# Altium project maze.PrjPCB
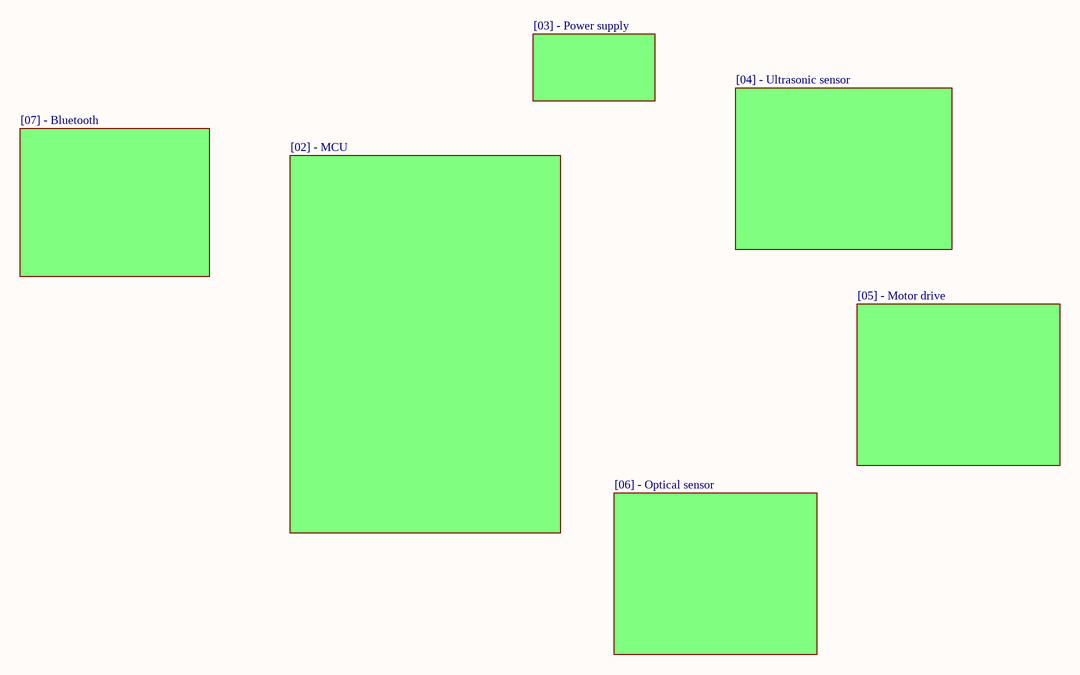
[diagram p0: [01] - sheet_connector.SchDoc]
3 sheets, 28 parts. Net scope: flat (ports and power ports of the same name join across sheets).
Sheets:
  [01] - sheet_connector.SchDoc
    Designator = [02] - MCU.SchDoc
    Designator = [03] - Power supply.SchDoc

## Sheet [01] - sheet_connector.SchDoc
size A4

### Sub-sheets
Designator = [02] - MCU: no entries
Designator = [04] - Ultrasonic sensor (file not in this document): no entries
Designator = [05] - Motor drive (file not in this document): no entries
Designator = [07] - Bluetooth (file not in this document): no entries
Designator = [06] - Optical sensor (file not in this document): no entries
Designator = [03] - Power supply: no entries

### Notes on the sheet
- Title
- Size:
- Date:
- A4
- Number:
- Time:
- Revision:
- Sheet
- of
- File:

## Sheet [02] - MCU.SchDoc
size A4
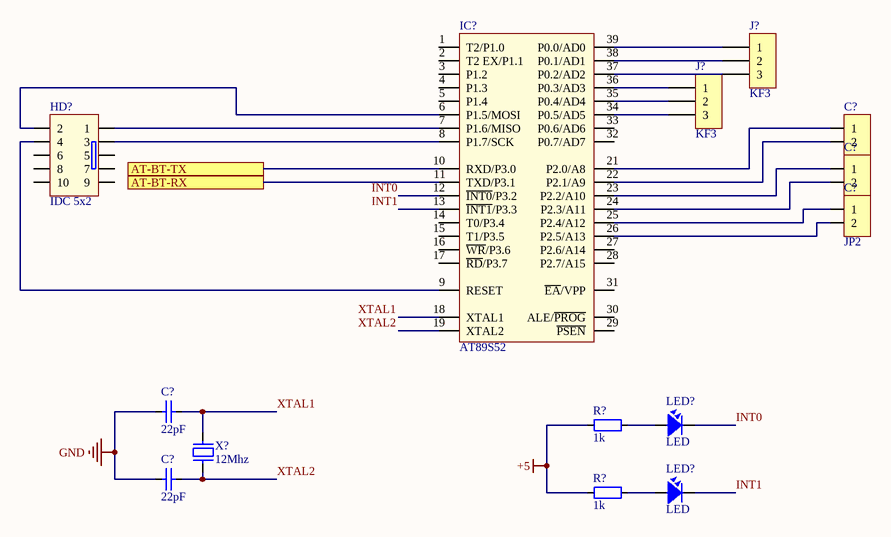
[diagram p1: [02] - MCU.SchDoc]

### Parts
(Parts that share a designator on the sheet are numbered #1, #2 ... from top to bottom, then left to right.)
C?#1  JP2  [JP2-C1T]
C?#2  JP2  [JP2-C1T]
C?#3  JP2  [JP2-C1T]
C?#4  22pF  [CAP_0402]
C?#5  22pF  [CAP_0402]
HD?  IDC 5x2  [IDC10-BH]
IC?  AT89S52  [DIP40/W0.6]
J?#1  KF3  [KF3-5.08T]
J?#2  KF3  [KF3-5.08T]
LED?#1  LED  [LED-3]
LED?#2  LED  [LED-3]
R?#1  1k  [RES-SMD-0402]
R?#2  1k  [RES-SMD-0402]
X?  12Mhz  [XT2]

### Ports
AT-BT-RX, AT-BT-TX

### Nets
+5: R?#1.1 R?#2.1
GND: C?#4.1 C?#5.1 IC?.20(GND)
VCC: IC?.40(VCC)
INT0: LED?#1.2
INT1: LED?#2.2
XTAL1: C?#4.2 X?.2
XTAL2: C?#5.2 X?.1
NetC?#1_1: C?#1.1 IC?.21(P2.0/A8)
NetC?#1_2: C?#1.2 IC?.22(P2.1/A9)
NetC?#2_1: C?#2.1 IC?.23(P2.2/A10)
NetC?#2_2: C?#2.2 IC?.24(P2.3/A11)
NetC?#3_1: C?#3.1 IC?.25(P2.4/A12)
NetC?#3_2: C?#3.2 IC?.26(P2.5/A13)
NetHD?_1: HD?.1 IC?.7(P1.6/MISO)
NetHD?_2: HD?.2 IC?.6(P1.5/MOSI)
NetHD?_3: HD?.3 IC?.8(P1.7/SCK)
NetHD?_4: HD?.4 IC?.9(RESET)
NetIC?_10: IC?.10(RXD/P3.0) ; port AT-BT-TX
NetIC?_11: IC?.11(TXD/P3.1) ; port AT-BT-RX
NetIC?_34: IC?.34(P0.5/AD5) J?#2.3
NetIC?_35: IC?.35(P0.4/AD4) J?#2.2
NetIC?_36: IC?.36(P0.3/AD3) J?#2.1
NetIC?_37: IC?.37(P0.2/AD2) J?#1.3
NetIC?_38: IC?.38(P0.1/AD1) J?#1.2
NetIC?_39: IC?.39(P0.0/AD0) J?#1.1
NetLED?#1_1: LED?#1.1 R?#1.2
NetLED?#2_1: LED?#2.1 R?#2.2

Not connected (* = marked no-connect by the designer): HD? 5 6 7 8 9 10; IC? 1(T2/P1.0) 2(T2_EX/P1.1) 3(P1.2) 4(P1.3) 5(P1.4) 12(~{INT0}/P3.2) 13(~{INT1}/P3.3) 14(T0/P3.4) 15(T1/P3.5) 16(~{WR}/P3.6) 17(~{RD}/P3.7) 18(XTAL1) 19(XTAL2) 27(P2.6/A14) 28(P2.7/A15) 29(~{PSEN}) 30(ALE/~{PROG}) 31(~{EA}/VPP) 32(P0.7/AD7) 33(P0.6/AD6)

### Notes on the sheet
- Labels drawn without touching a wire or pin: INT0, INT1, XTAL1, XTAL2
- Title
- Size:
- Date:
- A4
- Number:
- Time:
- Revision:
- Sheet
- of
- File:

### Library data of the parts
C?#1-C?#3 = JP2: WR-PHD 2.54 mm Angled Socket Header; Manufacturer: W¨¹rth Elektronik eiSos GmbH; partNo: 613002143121; ComponentLink1 Description: Manufacturer; ComponentLink2 Description: Datasheet; NoPins: 02; Created Date: 29 March 2013; ComponentLink1URL: http://www.we-online.com; ComponentLink2URL: http://katalog.we-online.de/em/datasheet/6130xx143121.pdf; Created by: Karrer Zheng
C?#4 C?#5 = CapSMD: Capacitor; Value: 33p; Published: 8-Jun-2000; LatestRevisionDate: 17-Jul-2002; LatestRevisionNote: Re-released for DXP Platform.; PackageReference: RAD-0.3; Publisher: Altium Limited
HD? = IDC 5X2: Value: Header 5x2
IC? = AT89S52: AT89S52, 8k Byte Flash Memory , 40 Pin; Value: AT89S52
J?#1 J?#2 = KF3: Manufacturer: Würth Elektronik eiSos GmbH; partNo: 691103110003; ComponentLink1 Description: Manufacturer; ComponentLink2 Description: Datasheet; NoPins: 3; Created Date: 29 October 2013; ComponentLink1URL: http://www.we-online.com; ComponentLink2URL: http://katalog.we-online.de/em/datasheet/6911031100xx.pdf; Created by: Karrer Zheng
LED?#1 LED?#2 = LED: LED Single colour Green and Red; Value: LED 3 ly Single Colour
R?#1 R?#2 = Resistor - SMD: Resistor; Manufacturer: Generic Components; Class: Passive; Published: 08/06/2000; Publisher: Altium Hobart Technology Centre
X? = XT2: Crystal For all Crystal 2pin.; Value: 4Mhz

## Sheet [03] - Power supply.SchDoc
size A4
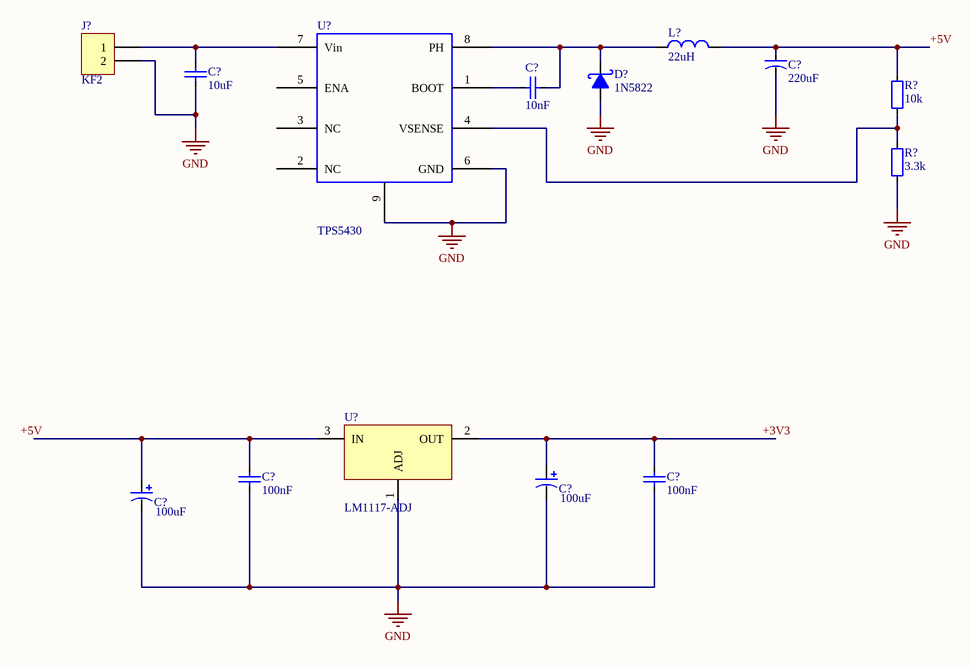
[diagram p2: [03] - Power supply.SchDoc]

### Parts
(Parts that share a designator on the sheet are numbered #1, #2 ... from top to bottom, then left to right.)
C?#6  220uF  [CAP-ALU-SMD-4.5x5x1.4]
C?#7  10nF  [CAP_0402]
C?#8  10uF  [CAP_0402]
C?#9  100uF  [CAP_7343]
C?#10  100uF  [CAP_7343]
C?#11  100nF  [CAP_0402]
C?#12  100nF  [CAP_0402]
D?  1N5822  [DIO-SMD-123]
J?#3  KF2  [KF2-5.08T]
L?  22uH  [L/0.4]
R?#3  10k  [RES-SMD-0101]
R?#4  3.3k  [RES-SMD-0101]
U?#1  TPS5430  [TPS5430-2]
U?#2  LM1117-ADJ  [LM1117-SOP]

### Nets
GND: C?#6.2 C?#8.1 C?#9.2 C?#10.2 C?#11.1 C?#12.1 D?.1(A) J?#3.2 R?#4.1 U?#1.6(GND) U?#1.9(PWR_PAD) U?#2.1(ADJ)
+3V3: C?#9.1 C?#12.2 U?#2.2(OUT)
+5V: C?#6.1 L?.2 R?#3.2
NetC?#7_1: C?#7.1 U?#1.1(BOOT)
NetC?#7_2: C?#7.2 D?.2(K) L?.1 U?#1.8(PH)
NetC?#8_2: C?#8.2 J?#3.1 U?#1.7(Vin)
NetC?#10_1: C?#10.1 C?#11.2 U?#2.3(IN)
NetR?#3_1: R?#3.1 R?#4.2 U?#1.4(VSENSE)

Not connected (* = marked no-connect by the designer): U?#1 2(NC) 3(NC) 5(ENA)

### Notes on the sheet
- Labels drawn without touching a wire or pin: +5V
- Title
- Size:
- Date:
- A4
- Number:
- Time:
- Revision:
- Sheet
- of
- File:

### Library data of the parts
C?#6 = CAP-ALU-SMD: Polarized Capacitor (Axial); Published: 8-Jun-2000; LatestRevisionDate: 17-Jul-2002; LatestRevisionNote: Re-released for DXP Platform.; PackageReference: POLAR0.8; Publisher: Altium Limited
C?#7 C?#8 C?#11 C?#12 = CapSMD: Capacitor; Value: 33p; Published: 8-Jun-2000; LatestRevisionDate: 17-Jul-2002; LatestRevisionNote: Re-released for DXP Platform.; PackageReference: RAD-0.3; Publisher: Altium Limited
C?#9 C?#10 = CAP_TAN_SMD: Polazied Tantalum Capacitor
D? = 1N5822: Schottky Rectifiers; Value: Diode c?m 1N5408
J?#3 = KF2: Manufacturer: Würth Elektronik eiSos GmbH; partNo: 691103110002; ComponentLink1 Description: Manufacturer; ComponentLink2 Description: Datasheet; NoPins: 2; Created Date: 29 October 2013; ComponentLink1URL: http://www.we-online.com; ComponentLink2URL: http://katalog.we-online.de/em/datasheet/6911031100xx.pdf; Created by: Karrer Zheng
L? = L1: Inductor; Value: 150 mH
R?#3 R?#4 = Resistor - SMD: as R?#1 on sheet [02] - MCU; Published: 08/06/2000; Publisher: Altium Hobart Technology Centre
U?#2 = LM1117-ADJ: 800mA Low-Dropout Linear Regulator; Creator: Nguyen Ba Bien; Website: http://group3i.net
U?#1 = TPS5430: Name: TPS5430

## Nets that join several sheets
GND: [02] - MCU (C?#4.1 C?#5.1 IC?.20), [03] - Power supply (12 pins)